# Altium schematic sheet config-top.SchDoc: Config FPGA - Top
size Letter; CompanyName: Brinton Engineering, LLC; Address1: 3479 Edison Way; Address2: Menlo Park CA 94025; Address3: +1 (877) 778-8435; Address4: brintonengineering.com; Revision: 1; SheetNumber: 1; SheetTotal: 1
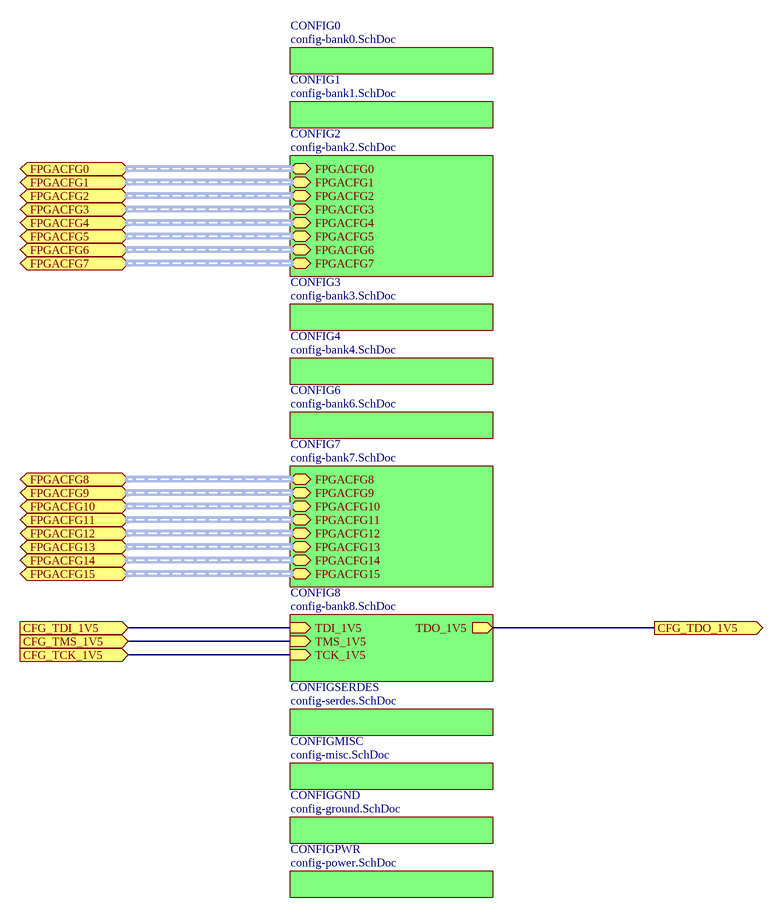
[diagram p0: config-top.SchDoc]

## Sub-sheets
CONFIG0 = config-bank0.SchDoc: no entries
CONFIG1 = config-bank1.SchDoc: no entries
CONFIG2 = config-bank2.SchDoc: FPGACFG0 (harness CONF_1V5), FPGACFG1 (harness CONF_1V5), FPGACFG2 (harness CONF_1V5), FPGACFG3 (harness CONF_1V5), FPGACFG4 (harness CONF_1V5), FPGACFG5 (harness CONF_1V5), FPGACFG6 (harness CONF_1V5), FPGACFG7 (harness CONF_1V5)
CONFIG3 = config-bank3.SchDoc: no entries
CONFIG4 = config-bank4.SchDoc: no entries
CONFIG6 = config-bank6.SchDoc: no entries
CONFIG7 = config-bank7.SchDoc: FPGACFG8 (harness CONF_1V5), FPGACFG9 (harness CONF_1V5), FPGACFG10 (harness CONF_1V5), FPGACFG11 (harness CONF_1V5), FPGACFG12 (harness CONF_1V5), FPGACFG13 (harness CONF_1V5), FPGACFG14 (harness CONF_1V5), FPGACFG15 (harness CONF_1V5)
CONFIG8 = config-bank8.SchDoc: TDO_1V5 (out), TDI_1V5 (in), TMS_1V5 (in), TCK_1V5 (in)
CONFIGGND = config-ground.SchDoc: no entries
CONFIGMISC = config-misc.SchDoc: no entries
CONFIGPWR = config-power.SchDoc: no entries
CONFIGSERDES = config-serdes.SchDoc: no entries

## Ports
CFG_TCK_1V5 (in), CFG_TDI_1V5 (in), CFG_TDO_1V5 (out), CFG_TMS_1V5 (in), FPGACFG0, FPGACFG1, FPGACFG2, FPGACFG3, FPGACFG4, FPGACFG5, FPGACFG6, FPGACFG7, FPGACFG8, FPGACFG9, FPGACFG10, FPGACFG11, FPGACFG12, FPGACFG13, FPGACFG14, FPGACFG15

## Nets
CFG_TCK_1V5: port CFG_TCK_1V5, sheet CONFIG8/TCK_1V5
CFG_TDI_1V5: port CFG_TDI_1V5, sheet CONFIG8/TDI_1V5
CFG_TDO_1V5: port CFG_TDO_1V5, sheet CONFIG8/TDO_1V5
CFG_TMS_1V5: port CFG_TMS_1V5, sheet CONFIG8/TMS_1V5

## Buses and harness runs
harness port FPGACFG0 = sheet CONFIG2/FPGACFG0
harness port FPGACFG1 = sheet CONFIG2/FPGACFG1
harness port FPGACFG2 = sheet CONFIG2/FPGACFG2
harness port FPGACFG3 = sheet CONFIG2/FPGACFG3
harness port FPGACFG4 = sheet CONFIG2/FPGACFG4
harness port FPGACFG5 = sheet CONFIG2/FPGACFG5
harness port FPGACFG6 = sheet CONFIG2/FPGACFG6
harness port FPGACFG7 = sheet CONFIG2/FPGACFG7
harness port FPGACFG8 = sheet CONFIG7/FPGACFG8
harness port FPGACFG9 = sheet CONFIG7/FPGACFG9
harness port FPGACFG10 = sheet CONFIG7/FPGACFG10
harness port FPGACFG11 = sheet CONFIG7/FPGACFG11
harness port FPGACFG12 = sheet CONFIG7/FPGACFG12
harness port FPGACFG13 = sheet CONFIG7/FPGACFG13
harness port FPGACFG14 = sheet CONFIG7/FPGACFG14
harness port FPGACFG15 = sheet CONFIG7/FPGACFG15

## Notes on the sheet
- Title
- Engineer
- Revision
- Drawn By
- Checked By
- Date
- Sheet
- of